# EAGLE design tvikia (EAGLE 5.06)
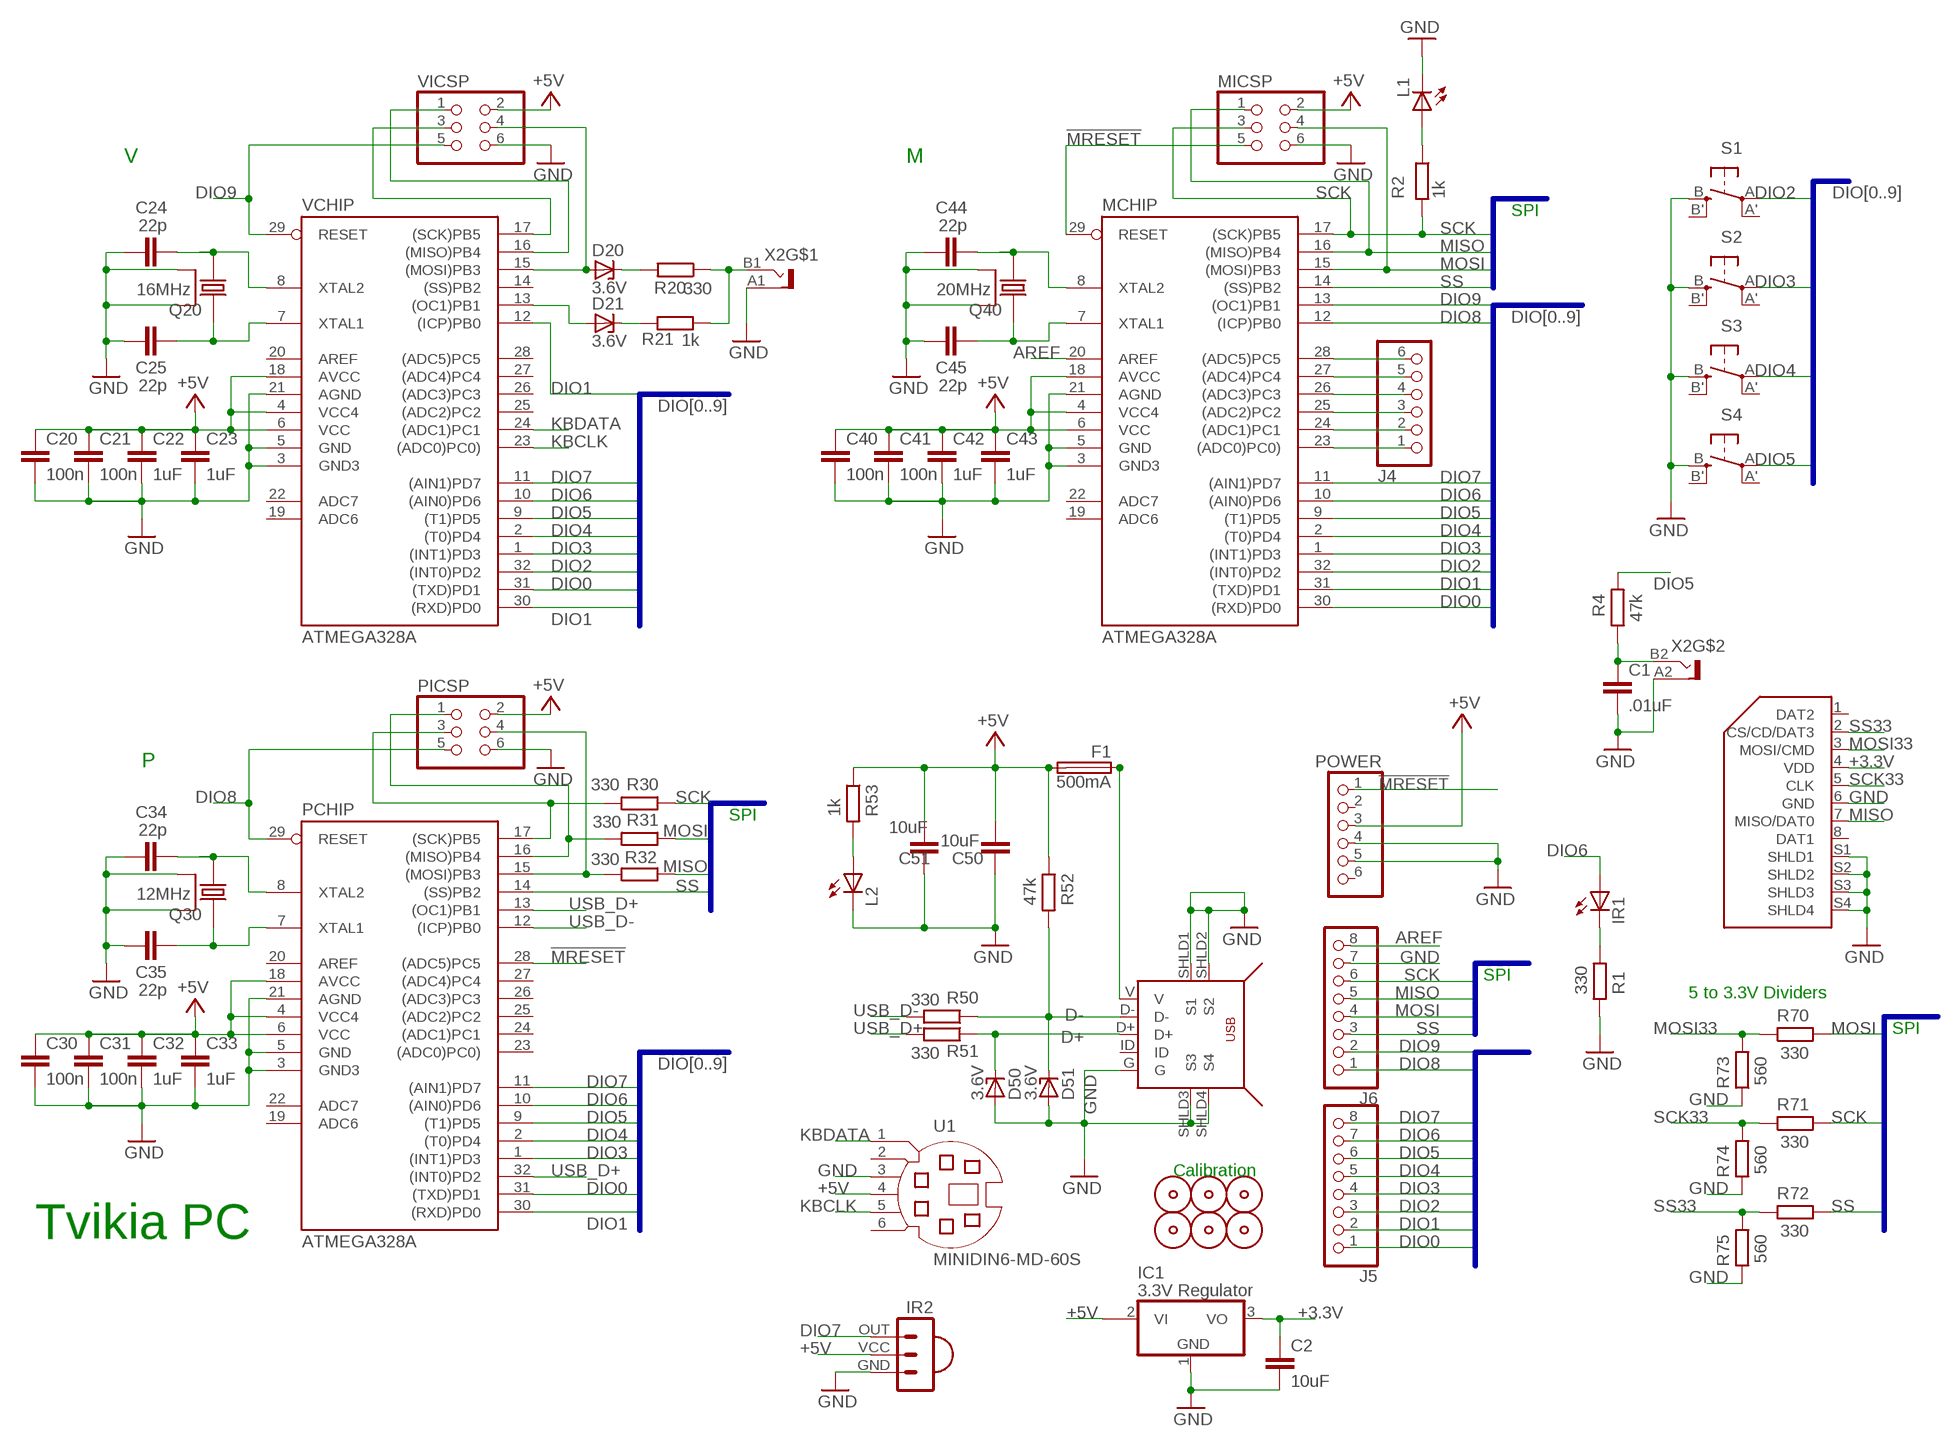
[diagram p0: schematic, sheet 1]

## Parts
C1  .01uF  C-EUC0603  [C0603]
C2  10uF  C-EUC0603  [C0603]
C20  100n  C-EUC0603  [C0603]
C21  100n  C-EUC0603  [C0603]
C22  1uF  C-EUC0603  [C0603]
C23  1uF  C-EUC0603  [C0603]
C24  22p  C-EUC0603  [C0603]
C25  22p  C-EUC0603  [C0603]
C30  100n  C-EUC0603  [C0603]
C31  100n  C-EUC0603  [C0603]
C32  1uF  C-EUC0603  [C0603]
C33  1uF  C-EUC0603  [C0603]
C34  22p  C-EUC0603  [C0603]
C35  22p  C-EUC0603  [C0603]
C40  100n  C-EUC0603  [C0603]
C41  100n  C-EUC0603  [C0603]
C42  1uF  C-EUC0603  [C0603]
C43  1uF  C-EUC0603  [C0603]
C44  22p  C-EUC0603  [C0603]
C45  22p  C-EUC0603  [C0603]
C50  10uF  C-EUC0603  [C0603]
C51  10uF  C-EUC0603  [C0603]
D20  3.6V  ZENER-DIODESOT23  [SOT23]
D21  3.6V  ZENER-DIODESOT23  [SOT23]
D50  3.6V  ZENER-DIODESOT23  [SOT23]
D51  3.6V  ZENER-DIODESOT23  [SOT23]
F1  500mA  FUSE0402  [0402]
IC1  3.3V Regulator  MCP170312MB  [SOT89]
IR1  LED5MM  [LED5MM]
IR2  IR-RECV-TSOP323  [IR-RECV-TSOP323]
J4  PINHD-1X6-CIRC  [1X06]
J5  PINHD-1X8-CIRC  [1X08]
J6  PINHD-1X8-CIRC  [1X08]
L1  LEDCHIP-LED0603  [CHIP-LED0603]
L2  LEDCHIPLED_0603  [CHIPLED_0603]
MCHIP  ATMEGA328A  [TQFP32-08]
MICSP  PINHD-2X3  [2X03]
PCHIP  ATMEGA328A  [TQFP32-08]
PICSP  PINHD-2X3  [2X03]
POWER  PINHD-1X6-CIRC  [1X06]
Q20  16MHz  NX3225SA  [NX3225SA]
Q30  12MHz  NX3225SA  [NX3225SA]
Q40  20MHz  NX3225SA  [NX3225SA]
R1  330  R-EU_R0603  [R0603]
R2  1k  R-EU_R0603  [R0603]
R4  47k  R-EU_R0603  [R0603]
R20  330  R-EU_R0603  [R0603]
R21  1k  R-EU_R0603  [R0603]
R30  330  R-EU_R0603  [R0603]
R31  330  R-EU_R0603  [R0603]
R32  330  R-EU_R0603  [R0603]
R50  330  R-EU_R0603  [R0603]
R51  330  R-EU_R0603  [R0603]
R52  47k  R-EU_R0603  [R0603]
R53  1k  R-EU_R0603  [R0603]
R70  330  R-EU_R0603  [R0603]
R71  330  R-EU_R0603  [R0603]
R72  330  R-EU_R0603  [R0603]
R73  560  R-EU_R0603  [R0603]
R74  560  R-EU_R0603  [R0603]
R75  560  R-EU_R0603  [R0603]
S1  EVQ-Q2P02W  [EVQ-Q2P02W]
S2  EVQ-Q2P02W  [EVQ-Q2P02W]
S3  EVQ-Q2P02W  [EVQ-Q2P02W]
S4  EVQ-Q2P02W  [EVQ-Q2P02W]
U1  MINIDIN6-MD-60S  [MINIDIN6-MD-60S]
U$1  CALIBRATION-MARK  [CALIBRATION-MARK]
U$4  CALIBRATION-MARK  [CALIBRATION-MARK]
U$5  CALIBRATION-MARK  [CALIBRATION-MARK]
U$6  CALIBRATION-MARK  [CALIBRATION-MARK]
U$8  MICROUSB-ZX62-B-5PA  [MICROUSB-ZX62-B-5PA]
U$9  MICROSD_3M_2900  [MICROSD_3M_2900]
U$10  CALIBRATION-MARK  [CALIBRATION-MARK]
U$12  CALIBRATION-MARK  [CALIBRATION-MARK]
VCHIP  ATMEGA328A  [TQFP32-08]
VICSP  PINHD-2X3  [2X03]
X2  DUAL-PHONO-161-4218-E  [DUAL-PHONO-161-4218-E]

## Nets
!MRESET: MCHIP.29(RESET) MICSP.5 PCHIP.28((ADC5)PC5) POWER.1
+3.3V: C2.1 IC1.3(VO) U$9.4(VDD)
+5V: C20.1 C21.1 C22.1 C23.1 C30.1 C31.1 C32.1 C33.1 C40.1 C41.1 C42.1 C43.1 C50.1 C51.1 F1.2 IC1.2@1(VI1) IR2.VCC MCHIP.4(VCC4) MCHIP.6(VCC) MCHIP.18(AVCC) MICSP.2 PCHIP.4(VCC4) PCHIP.6(VCC) PCHIP.18(AVCC) PICSP.2 POWER.3 R52.1 R53.1 U1.4 VCHIP.4(VCC4) VCHIP.6(VCC) VCHIP.18(AVCC) VICSP.2
AREF: J6.8 MCHIP.20(AREF)
D+: D50.3(C) R51.1 U$8.D+
D-: D51.3(C) R50.1 R52.2 U$8.D-
DIO0: J5.1 MCHIP.30((RXD)PD0) PCHIP.31((TXD)PD1) VCHIP.31((TXD)PD1)
DIO1: J5.2 MCHIP.31((TXD)PD1) PCHIP.30((RXD)PD0) VCHIP.12((ICP)PB0) VCHIP.30((RXD)PD0)
DIO2: J5.3 MCHIP.32((INT0)PD2) S1.A(P) VCHIP.32((INT0)PD2)
DIO3: J5.4 MCHIP.1((INT1)PD3) PCHIP.1((INT1)PD3) S2.A(P) VCHIP.1((INT1)PD3)
DIO4: J5.5 MCHIP.2((T0)PD4) PCHIP.2((T0)PD4) S3.A(P) VCHIP.2((T0)PD4)
DIO5: J5.6 MCHIP.9((T1)PD5) PCHIP.9((T1)PD5) R4.2 S4.A(P) VCHIP.9((T1)PD5)
DIO6: IR1.A J5.7 MCHIP.10((AIN0)PD6) PCHIP.10((AIN0)PD6) VCHIP.10((AIN0)PD6)
DIO7: IR2.OUT J5.8 MCHIP.11((AIN1)PD7) PCHIP.11((AIN1)PD7) VCHIP.11((AIN1)PD7)
DIO8: J6.1 MCHIP.12((ICP)PB0) PCHIP.29(RESET) PICSP.5
DIO9: J6.2 MCHIP.13((OC1)PB1) VCHIP.29(RESET) VICSP.5
GND [power]: C1.2 C2.2 C20.2 C21.2 C22.2 C23.2 C24.1 C25.1 C30.2 C31.2 C32.2 C33.2 C34.1 C35.1 C40.2 C41.2 C42.2 C43.2 C44.1 C45.1 C50.2 C51.2 D50.1(A) D51.1(A) IC1.1(GND) IR2.GND J6.7 L1.C L2.C MCHIP.3(GND3) MCHIP.5(GND) MCHIP.21(AGND) MICSP.6 PCHIP.3(GND3) PCHIP.5(GND) PCHIP.21(AGND) PICSP.6 POWER.4 POWER.5 Q20.2(GND2) Q20.4(GND) Q30.2(GND2) Q30.4(GND) Q40.2(GND2) Q40.4(GND) R1.2 R73.1 R74.1 R75.1 S1.B(S) S2.B(S) S3.B(S) S4.B(S) U1.3 U$8.G U$8.SHLD1(S1) U$8.SHLD2(S2) U$8.SHLD3(S3) U$8.SHLD4(S4) U$9.6(GND) U$9.S1(SHLD1) U$9.S2(SHLD2) U$9.S3(SHLD3) U$9.S4(SHLD4) VCHIP.3(GND3) VCHIP.5(GND) VCHIP.21(AGND) VICSP.6 X2.A1 X2.A2
KBCLK: U1.5 VCHIP.23((ADC0)PC0))
KBDATA: U1.1 VCHIP.24((ADC1)PC1)
MISO: J6.5 MCHIP.16((MISO)PB4) MICSP.1 R32.1 U$9.7(MISO/DAT0)
MOSI: J6.4 MCHIP.15((MOSI)PB3) MICSP.4 R31.1 R70.2
MOSI33: R70.1 R73.2 U$9.3(MOSI/CMD)
N$2: IR1.K(C) R1.1
N$3: L2.A R53.2
N$4: C34.2 PCHIP.8(XTAL2) Q30.1
N$5: C1.1 R4.1 X2.B2
N$8: F1.1 U$8.V
N$9: VCHIP.16((MISO)PB4) VICSP.1
N$10: C24.2 Q20.1 VCHIP.8(XTAL2)
N$11: C25.2 Q20.3 VCHIP.7(XTAL1)
N$12: D20.3(C) R20.2
N$13: D21.1(A) VCHIP.13((OC1)PB1)
N$14: D21.3(C) R21.1
N$15: R20.1 R21.2 X2.B1
N$23: C35.2 PCHIP.7(XTAL1) Q30.3
N$24: VCHIP.17((SCK)PB5) VICSP.3
N$28: C44.2 MCHIP.8(XTAL2) Q40.1
N$29: C45.2 MCHIP.7(XTAL1) Q40.3
N$30: J4.1 MCHIP.23((ADC0)PC0))
N$31: J4.2 MCHIP.24((ADC1)PC1)
N$32: J4.3 MCHIP.25((ADC2)PC2)
N$33: J4.4 MCHIP.26((ADC3)PC3)
N$34: J4.5 MCHIP.27((ADC4)PC4)
N$35: J4.6 MCHIP.28((ADC5)PC5)
N$37: L1.A R2.1
PIXEL1: D20.1(A) VCHIP.15((MOSI)PB3) VICSP.4
PMISO: PCHIP.15((MOSI)PB3) PICSP.4 R32.2
PMOSI: PCHIP.16((MISO)PB4) PICSP.1 R31.2
PSCK: PCHIP.17((SCK)PB5) PICSP.3 R30.2
SCK: J6.6 MCHIP.17((SCK)PB5) MICSP.3 R2.2 R30.1 R71.2
SCK33: R71.1 R74.2 U$9.5(CLK)
SS: J6.3 MCHIP.14((SS)PB2) PCHIP.14((SS)PB2) R72.2
SS33: R72.1 R75.2 U$9.2(CS/CD/DAT3)
USB_D+: PCHIP.13((OC1)PB1) PCHIP.32((INT0)PD2) R51.2
USB_D-: PCHIP.12((ICP)PB0) R50.2
Unconnected: IC1.2(VI) MCHIP.19(ADC6) MCHIP.22(ADC7) PCHIP.19(ADC6) PCHIP.20(AREF) PCHIP.22(ADC7) PCHIP.23((ADC0)PC0)) PCHIP.24((ADC1)PC1) PCHIP.25((ADC2)PC2) PCHIP.26((ADC3)PC3) PCHIP.27((ADC4)PC4) POWER.2 POWER.6 S1.A'(P1) S1.B'(S1) S2.A'(P1) S2.B'(S1) S3.A'(P1) S3.B'(S1) S4.A'(P1) S4.B'(S1) U1.2 U1.6 U$8.ID U$9.1(DAT2) U$9.8(DAT1) VCHIP.14((SS)PB2) VCHIP.19(ADC6) VCHIP.20(AREF) VCHIP.22(ADC7) VCHIP.25((ADC2)PC2) VCHIP.26((ADC3)PC3) VCHIP.27((ADC4)PC4) VCHIP.28((ADC5)PC5)

## Buses
DIO[0..9]
SPI:SCK,MOSI,MISO,SS

## Notes on the sheet
- V | M
- SPI
- P
- SPI
- SPI
- 5 to 3.3V Dividers
- SPI
- Calibration
- Tvikia PC

## Library data of the parts
C1 C2 C20-C25 C30-C35 C40-C45 C50 C51 = rcl:C-EU: CAPACITOR, European symbol
D20 D21 D50 D51 = diode:ZENER-DIODE: Z-Diode
F1 = tvikia:FUSE0402
IC1 = linear:MCP1703*: 250 mA, 16V, Low Quiescent Current LDO Regulator Source: http://ww1.microchip.com/downloads/en/DeviceDoc/22049b.pdf
IR1 L1 L2 = led:LED: LED OSRAM: - CHIPLED LG R971, LG N971, LY N971, LG Q971, LY Q971, LO R971, LY R971 LH N974, LH R974 LS Q976, LO Q976, LY Q976 LO Q996 - Hyper CHIPLED LW Q18S LB Q993, LB Q99A, LB R99A - SideLED LS A670, LO A670, LY A670, LG A670, LP A670 LB A673, LV A673, LT A673, LW A673 LH A674 LY A675 LS A676, LA A676, LO A676, LY A676, LW A676 LS A679, LY A679, LG A679 - Hyper Micro SIDELED® LS Y876, LA Y876, LO Y876, LY Y876 LT Y87S - SmartLED LW L88C, LW L88S LB L89C, LB L89S, LG L890 LS L89K, LO L89K, LY L89K LS L896, LA L896, LO L896, LY L896 - TOPLED LS T670, LO T670, LY T670, LG T670, LP T670 LSG T670, LSP T670, LSY T670, LOP T670, LYG T670 LG T671, LOG T671, LSG T671 LB T673, LV T673, LT T673, LW T673 LH T674 LS T676, LA T676, LO T676, LY T676, LB T676, LH T676, LSB T676, LW T676 LB T67C, LV T67C, LT T67C, LS T67K, LO T67K, LY T67K, LW E67C LS E67B, LA E67B, LO E67B, LY E67B, LB E67C, LV E67C, LT E67C LW T67C LS T679, LY T679, LG T679 LS T770, LO T770, LY T770, LG T770, LP T770 LB T773, LV T773, LT T773, LW T773 LH T774 LS E675, LA E675, LY E675, LS T675 LS T776, LA T776, LO T776, LY T776, LB T776 LHGB T686 LT T68C, LB T68C - Hyper Mini TOPLED® LB M676 - Mini TOPLED Santana® LG M470 LS M47K, LO M47K, LY M47K Source: http://www.osram.convergy.de LUXEON: - LUMILED® LXK2-PW12-R00, LXK2-PW12-S00, LXK2-PW14-U00, LXK2-PW14-V00 LXK2-PM12-R00, LXK2-PM12-S00, LXK2-PM14-U00 LXK2-PE12-Q00, LXK2-PE12-R00, LXK2-PE12-S00, LXK2-PE14-T00, LXK2-PE14-U00 LXK2-PB12-K00, LXK2-PB12-L00, LXK2-PB12-M00, LXK2-PB14-N00, LXK2-PB14-P00, LXK2-PB14-Q00 LXK2-PR12-L00, LXK2-PR12-M00, LXK2-PR14-Q00, LXK2-PR14-R00 LXK2-PD12-Q00, LXK2-PD12-R00, LXK2-PD12-S00 LXK2-PH12-R00, LXK2-PH12-S00 LXK2-PL12-P00, LXK2-PL12-Q00, LXK2-PL12-R00 Source: www.luxeon.com KINGBRIGHT: KA-3528ASYC Source: www.kingbright.com
IR2 = tvikia:IR-RECV-TSOP323
J4 POWER = tvikia:PINHD-1X6-CIRC: PIN HEADER
J5 J6 = tvikia:PINHD-1X8-CIRC: PIN HEADER
MCHIP PCHIP VCHIP = tvikia:ATMEGA328: MICROCONTROLLER 4 Kbytes FLASH 128 bytes SRAM 256 bytes EEPROM UART 6-channel 10 bit ADC
MICSP PICSP VICSP = pinhead:PINHD-2X3: PIN HEADER
Q20 Q30 Q40 = tvikia:NX3225SA
R1 R2 R4 R20 R21 R30-R32 R50-R53 R70-R75 = rcl:R-EU_: RESISTOR, European symbol
S1-S4 = tvikia:EVQ-Q2P02W
U1 = tvikia:MINIDIN6-MD-60S
U$1 U$4-U$6 U$10 U$12 = tvikia:CALIBRATION-MARK: Calibration mark for board pick-n-place.
U$8 = tvikia:MICROUSB-ZX62-B-5PA
U$9 = tvikia:MICROSD_3M_2900
X2 = tvikia:DUAL-PHONO-161-4218-E

## Net classes
0 default: width 0.203 mm, drill 0.305 mm, clearance 0.203 mm
1 power: width 0.356 mm, drill 0.305 mm, clearance 0.203 mm
2 gnd: width 0.356 mm, drill 0.305 mm, clearance 0.203 mm

## Board
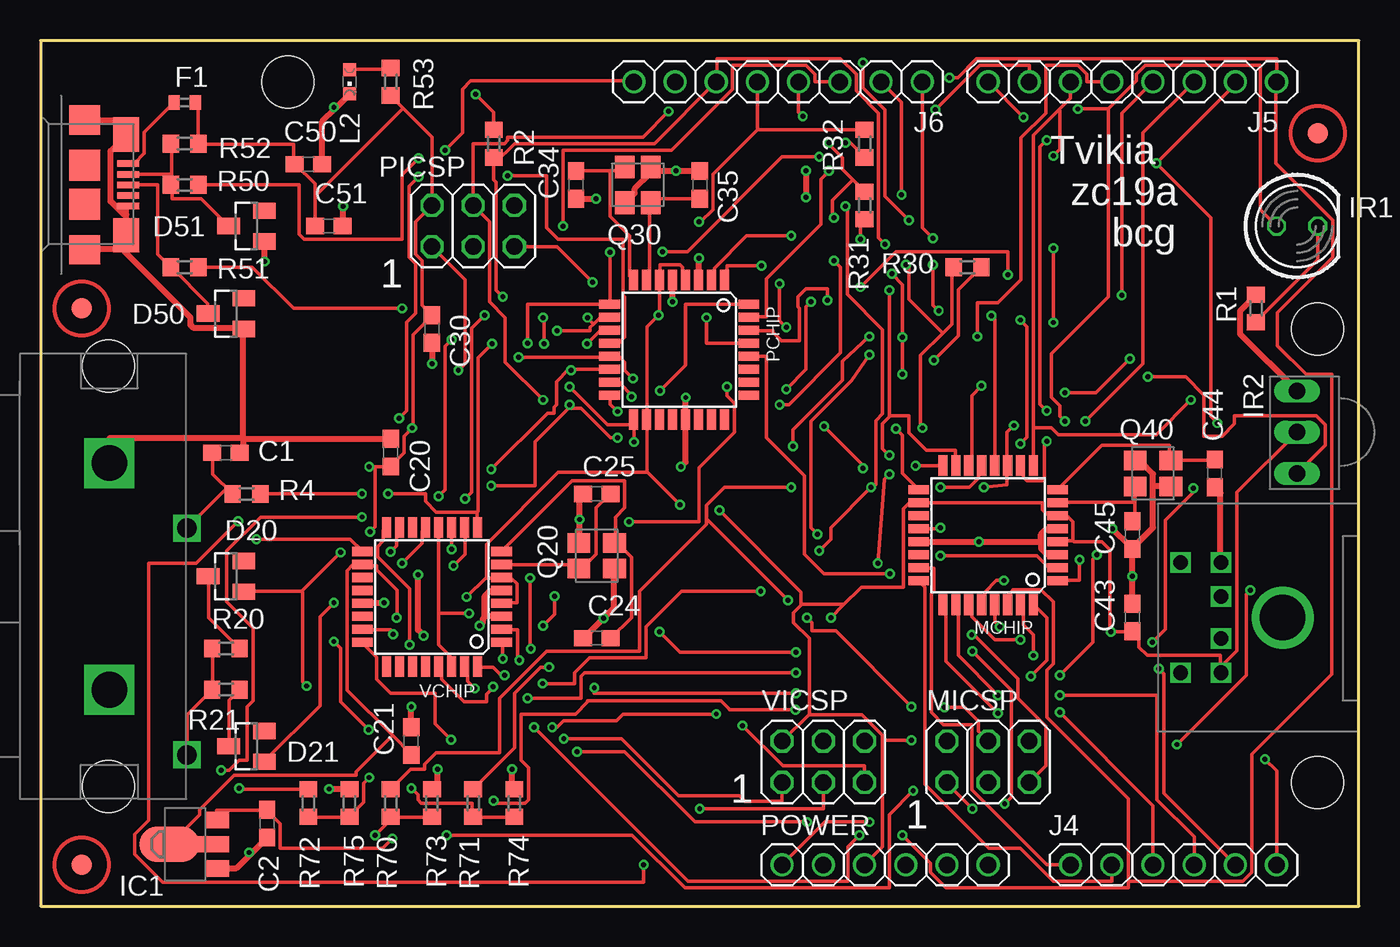
[diagram p1: board, top side]
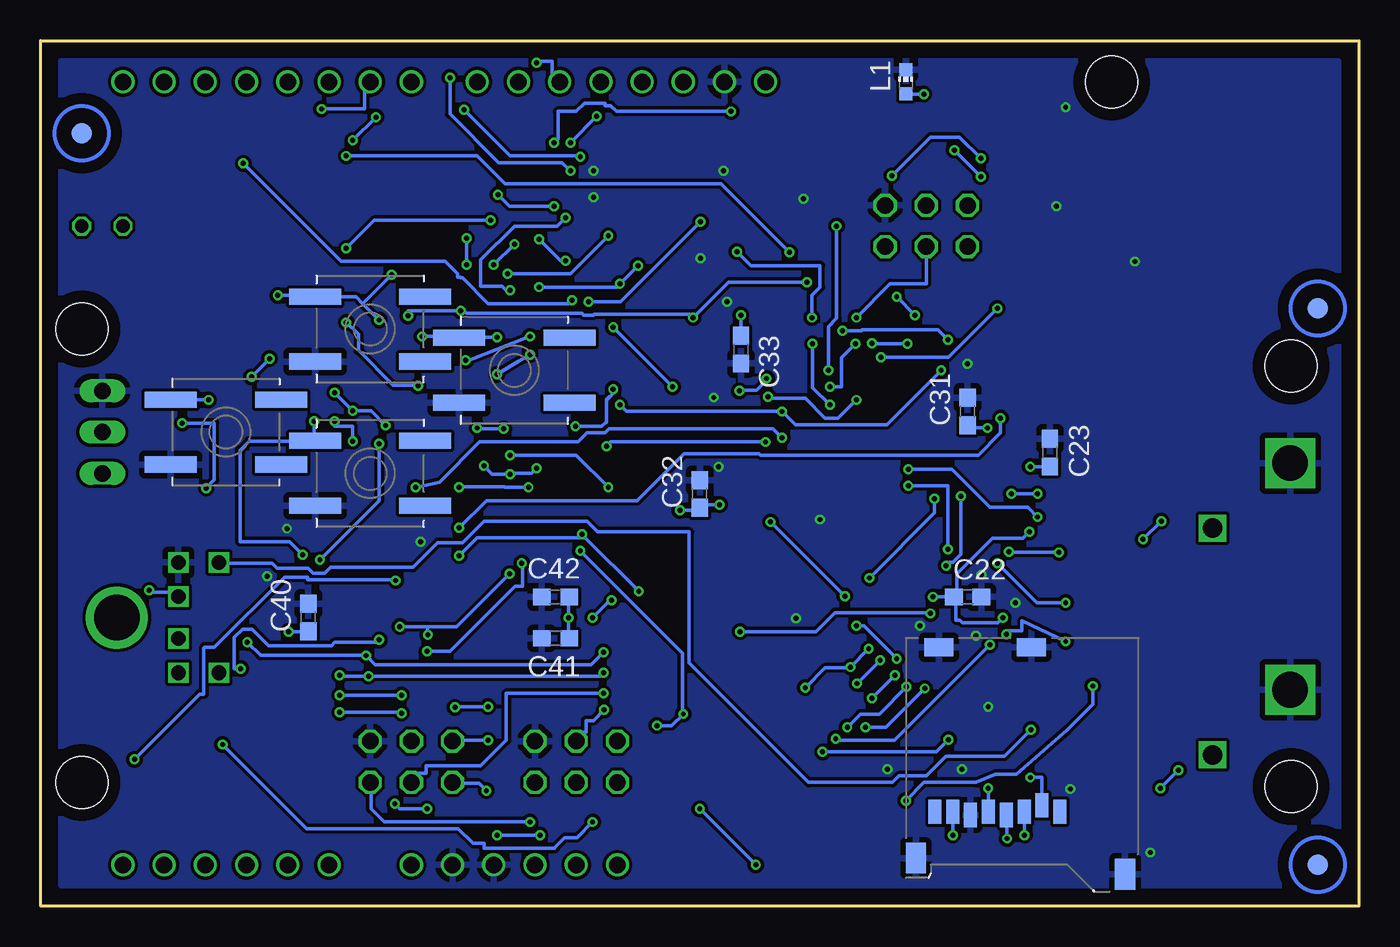
[diagram p2: board, bottom side, seen from below]

Size 81.28 x 53.34 mm. Coordinates in mm from the lower left corner, seen from the top.
Outline: 0,0 81.28,0 81.28,53.34 0,53.34 0,0
Copper layers (1*16): Top 0.035mm / dielectric 1.5mm / Bottom 0.035mm
Design rules "chung_nam_design_rules *": minimum track width 8mil, minimum drill 12mil, track to track 8mil, track to pad 8mil, pad to pad 5mil, via to via 15mil, smd to smd 5mil, copper to edge 30mil, drill to drill 30mil, minimum pad ring 7mil, minimum via ring 6mil, stop-mask expansion 3mil, vias tented up to drill 0mil, thermal gap 14mil
Holes 3.2 mm at 15.24,50.8 78.74,35.56 78.74,7.62

### Footprints (pad centres in the part's own frame; a part is rotated, then mirrored left to right if it is on the bottom)
C0603 = smd 1.1 x 1: 1 -0.85,0; 2 0.85,0
SOT23 = smd 1 x 1.4: 1 -0.95,-1.1; 2 0.95,-1.1; 3 0,1.1
0402 = smd 0.7 x 0.9: 1 -0.65,0; 2 0.65,0
SOT89 = smd 1 x 1.5: 1 -1.499,-1.981; 3 1.499,-1.981 | smd 1 x 2: 2 0,-1.727 | smd 2.2 x 3.7: 2@1 0,0.94
LED5MM = drill 0.813 octagon: A -1.27,0; K 1.27,0
IR-RECV-TSOP323 = drill 1.016 long: GND -2.54,0; OUT 2.54,0; VCC 0,0
1X06 = drill 1.016 round: 1 -6.35,0; 2 -3.81,0; 3 -1.27,0; 4 1.27,0; 5 3.81,0; 6 6.35,0
1X08 = drill 1.016 round: 1 -8.89,0; 2 -6.35,0; 3 -3.81,0; 4 -1.27,0; 5 1.27,0; 6 3.81,0; 7 6.35,0; 8 8.89,0
CHIP-LED0603 = smd 0.8 x 0.8: A 0,-0.75; C 0,0.75
CHIPLED_0603 = smd 0.8 x 0.8: A 0,-0.75; C 0,0.75
TQFP32-08 = smd 1.27 x 0.559: 1 -4.293,2.8; 2 -4.293,2; 3 -4.293,1.2; 4 -4.293,0.4; 5 -4.293,-0.4; 6 -4.293,-1.2; 7 -4.293,-2; 8 -4.293,-2.8; 17 4.293,-2.8; 18 4.293,-2; 19 4.293,-1.2; 20 4.293,-0.4; 21 4.293,0.4; 22 4.293,1.2; 23 4.293,2; 24 4.293,2.8 | smd 0.559 x 1.27: 9 -2.8,-4.293; 10 -2,-4.293; 11 -1.2,-4.293; 12 -0.4,-4.293; 13 0.4,-4.293; 14 1.2,-4.293; 15 2,-4.293; 16 2.8,-4.293; 25 2.8,4.293; 26 2,4.293; 27 1.2,4.293; 28 0.4,4.293; 29 -0.4,4.293; 30 -1.2,4.293; 31 -2,4.293; 32 -2.8,4.293
2X03 = drill 1.016 octagon: 1 -2.54,-1.27; 2 -2.54,1.27; 3 0,-1.27; 4 0,1.27; 5 2.54,-1.27; 6 2.54,1.27
NX3225SA = smd 1.4 x 1.2: 1 -1.1,-0.8; 2 1.1,-0.8; 3 1.1,0.8; 4 -1.1,0.8
R0603 = smd 1 x 1.1: 1 -0.85,0; 2 0.85,0
EVQ-Q2P02W = smd 3.2 x 1: A -3.4,2; A' 3.4,2; B -3.4,-2; B' 3.4,-2
MINIDIN6-MD-60S = drill 0.9 square: 1 -1.3,-8.5; 2 1.3,-8.5; 3 -3.4,-8.5; 4 3.4,-8.5; 5 -3.4,-11; 6 3.4,-11 | drill 2.8 round: P$7 0,-4.7
CALIBRATION-MARK = smd 1.27 x 1.27: P$1 0,0
MICROUSB-ZX62-B-5PA = smd 0.4 x 1.35: D+ 0,4.13; D- -0.65,4.13; G 1.3,4.13; ID 0.65,4.13; V -1.3,4.13 | smd 1.9 x 1.9: P$8 1.2,1.45; P$9 -1.2,1.45 | smd 2.1 x 1.6: SHLD1 -3.1,4; SHLD2 3.1,4 | smd 1.8 x 1.9: SHLD3 -4,1.45; SHLD4 4,1.45
MICROSD_3M_2900 = smd 0.8 x 1.5: 1 -9.5,10.7; 2 -8.4,10.3; 3 -7.3,10.7; 4 -6.2,10.9; 5 -5.1,10.7; 6 -4,10.9; 7 -2.9,10.7; 8 -1.8,10.7 | smd 1.24 x 1.9: S1 -13.52,14.55; S2 -0.62,13.55 | smd 1.8 x 1.1: S3 -7.75,0.55; S4 -2.05,0.55
DUAL-PHONO-161-4218-E = drill 2.2 square: A1 -6.985,-5.512; A2 6.985,-5.512 | drill 1.2 square: B1 -10.998,-10.287; B2 2.972,-10.287 | hole 3.2: -12.954,-5.461; 12.954,-5.461

### Placement (x,y rotation side)
C1  11.43,27.94 0 top
C2  13.97,5.08 270 top
C20  21.59,27.94 90 top
C21  22.86,10.16 90 top
C22  24.13,19.05 0 bottom
C23  19.05,27.94 90 bottom
C24  34.29,16.51 0 top
C25  34.29,25.4 0 top
C30  24.13,35.56 270 top
C31  24.13,30.48 90 bottom
C32  40.64,25.4 90 bottom
C33  38.1,34.29 270 bottom
C34  33.02,44.45 90 top
C35  40.64,44.45 270 top
C40  64.77,17.78 90 bottom
C41  49.53,16.51 180 bottom
C42  49.53,19.05 180 bottom
C43  67.31,17.78 90 top
C44  72.39,26.67 90 top
C45  67.31,22.86 90 top
C50  16.51,45.72 0 top
C51  17.78,41.91 0 top
D20  11.43,20.32 90 top
D21  12.7,9.84 90 top
D50  11.43,36.51 90 top
D51  12.7,41.91 90 top
F1  8.89,49.53 0 top
IC1  8.89,3.81 90 top
IR1  77.47,41.91 0 top
IR2  77.47,29.21 270 top
J4  69.85,2.54 0 top
J5  67.31,50.8 180 top
J6  45.47,50.8 180 top
L1  27.94,50.8 0 bottom
L2  19.05,50.8 180 top
MCHIP  58.42,22.86 180 top
MICSP  58.42,8.89 0 top
PCHIP  39.37,34.29 270 top
PICSP  26.67,41.91 0 top
POWER  52.07,2.54 0 top
Q20  34.29,21.59 180 top
Q30  36.83,44.45 270 top
Q40  68.58,26.67 180 top
R1  74.93,36.83 90 top
R2  27.94,46.99 270 top
R4  12.7,25.4 0 top
R20  11.43,15.88 0 top
R21  11.43,13.34 180 top
R30  57.15,39.37 0 top
R31  50.8,43.18 270 top
R32  50.8,46.99 270 top
R50  8.89,44.45 0 top
R51  8.89,39.37 0 top
R52  8.89,46.99 180 top
R53  21.59,50.8 90 top
R70  21.59,6.35 90 top
R71  26.67,6.35 90 top
R72  16.51,6.35 90 top
R73  24.13,6.35 270 top
R74  29.21,6.35 270 top
R75  19.05,6.35 270 top
S1  60.96,26.67 0 bottom
S2  60.96,35.56 0 bottom
S3  52.07,33.02 0 bottom
S4  69.85,29.21 0 bottom
U1  81.28,17.78 270 top
U$1  78.74,47.62 0 bottom
U$4  2.54,2.54 0 top
U$5  78.74,47.62 0 top
U$6  2.54,36.83 0 top
U$8  1.27,44.45 270 top
U$9  27.94,16.51 180 bottom
U$10  2.54,2.54 0 bottom
U$12  2.54,36.83 0 bottom
VCHIP  24.13,19.05 180 top
VICSP  48.26,8.89 0 top
X2  -1.27,20.32 90 top

### Tracks (layer width: path | path; a pad name or v marks a point on that pad's centre or on a via)
!MRESET  (via drill 0.3)
  Top 0.203: POWER.1 48.36,5.18 v51.1,5.18 | v52.38,20.47 48.31,20.47 47.09,21.69 47.09,26.52 44.76,28.85 44.76,33.88 43.69,33.88 PCHIP.28 | v59.13,17.22 58.83,17.53 58.83,18.54 MCHIP.29 | MICSP.5 61.98,8.64 61.98,11.07 60.25,12.8 60.25,14.02 57.56,16.71 v57.4,16.71
  Bottom 0.203: v51.1,5.18 60.1,5.18 60.91,5.99 60.91,7.62 MICSP.5 | v52.38,20.47 55.63,17.22 57.4,17.22 | 57.4,17.22 v59.13,17.22 | v57.4,16.71 57.4,17.22
+3.3V  (via drill 0.3)
  Top 0.203: IC1.3 10.87,5.33 10.87,5.89 13.97,5.89 C2.1 14.02,5.84 14.78,5.08 14.78,3.56 21.08,3.56 v21.69,4.17
  Bottom 0.203: v21.69,4.17 21.69,5.59 U$9.4
+5V  (via drill 0.3)
  Top 0.203: 20.62,27.08 21.59,27.08 C20.1 21.64,27.18 22.4,27.94 22.4,28.96 v22.91,29.46 22.96,29.52 22.96,35.2 24.13,36.37 C30.1 24.08,36.47 23.52,37.03 23.52,39.78 23.11,40.18 23.11,42.16 PICSP.2 24.13,47.4 22.35,49.17 | 20.62,27.08 v20.27,27.08 | 22.35,49.17 21.59,49.94 R53.1 | F1.2 9.7,49.38 9.7,46.99 R52.1 9.8,46.94 15.6,46.94 15.6,45.77 C50.1 15.7,45.72 16.92,44.5 16.92,43.79 | 16.92,43.79 16.92,41.91 C51.1 | 22.35,49.17 16.97,43.79 16.92,43.79 | 21.69,10.52 18.9,13.31 18.9,20.68 19.25,21.03 19.81,21.03 VCHIP.18 19.91,20.98 20.73,20.98 20.73,20.73 22,19.46 22,17.83 v21.95,17.78 | 21.69,10.52 22.86,9.35 C21.1 | IC1.2@1 7.98,3.81 9.8,5.64 9.8,5.94 11.94,8.08 19.46,8.08 19.46,8.28 21.69,10.52 | PCHIP.4 39.73,38.61 39.57,38.76 39.57,39.37 39.42,39.52 38.2,39.52 38.2,38.66 PCHIP.6 38.15,38.56 38.15,36.47 v38.1,36.42 37.39,35.71 37.39,30.07 PCHIP.18 37.39,29.97 37.39,26.77 | v26.26,19.05 27.43,20.22 | 27.43,20.22 28.4,20.22 VCHIP.6 28.5,20.22 29.01,20.22 29.36,19.86 29.36,18.69 28.45,18.69 VCHIP.4 | 37.39,26.77 v39.42,24.74 | 27.43,20.22 27.48,20.27 27.48,22.3 31.9,26.72 37.34,26.72 37.39,26.77 | IR2.VCC 73.76,25.5 73.76,15.75 72.8,14.78 U1.4 72.75,14.43 72.75,15.44 68.22,15.44 67.72,15.95 67.72,16.51 67.36,16.87 C43.1 67.31,16.92 v65.99,16.92 65.94,16.97 65.94,21.95 65.43,22.45 63.7,22.45 63.65,22.5 | 63.65,22.5 62.74,22.5 MCHIP.4 | 63.65,22.5 63.65,23.67 63.3,24.03 62.74,24.03 MCHIP.6 62.64,24.08 62.13,24.08 61.77,24.43 61.77,24.84 54.15,24.84 MCHIP.18 54.05,24.79 53.49,24.79 53.19,24.49 53.19,19.66 50.6,19.66 49.48,18.54 | 49.48,18.54 v48.72,17.78
  Top 0.203: 47.4,11.84 VICSP.2 | 47.4,11.84 47.4,16.51 46.43,17.48 46.43,18.09 46.94,18.59 | 46.94,18.59 49.43,18.59 49.48,18.54 | POWER.3 51.92,3.66 51.92,10.21 | 51.92,10.21 51.92,10.52 50.65,11.79 47.45,11.79 47.4,11.84 | 51.92,10.21 v53.7,10.21 | v41.86,24.38 46.89,19.36 46.89,18.64 46.94,18.59 | v20.32,23.06 20.62,23.37 20.62,27.08
  Bottom 0.203: v20.27,27.08 19.05,27.08 C23.1 | v22.91,29.46 23.98,29.46 24.13,29.62 C31.1 | v38.1,36.42 C33.1 | C22.1 v26.26,19.05 | v39.42,24.74 40.49,24.74 40.64,24.59 C32.1 40.69,24.49 40.79,24.38 v41.86,24.38 | v65.99,16.92 64.77,16.92 C40.1 | C41.1 48.72,16.51 v48.72,17.78 48.72,19.05 C42.1 | MICSP.2 55.83,10.21 v53.7,10.21 | v21.95,17.78 22.25,17.48 24.43,17.48 24.59,17.63 24.84,17.63 24.84,19 24.89,19 C22.1 | v20.32,23.06 20.73,22.66 22.61,22.66 24.79,20.47 24.79,19.05 C22.1
AREF  (via drill 0.3)
  Top 0.203: v55.47,23.32 55.47,23.27 54.15,23.27 MCHIP.20 | v22.1,30.07 22.55,30.53 22.55,35.97 23.11,36.52 23.11,39.57 22.71,39.98 22.71,44.35 v23.32,44.96 | v24.94,46.58 26.01,47.65 26.01,50.34 26.52,50.85 36.58,50.85 J6.8
  Bottom 0.203: v55.47,23.32 53.8,24.99 44.5,24.99 41.6,27.89 36.98,27.89 36.88,27.79 23.47,27.79 22.1,29.16 v22.1,30.07 | v23.32,44.96 v24.94,46.58
D+
  Top 0.203: D50.3 10.31,36.52 10.31,37.13 8.08,39.37 R51.1 7.98,39.42 7.21,40.18 7.21,44.45 U$8.D+
D-
  Top 0.203: 8.08,45.11 8.08,46.99 R52.2 | 8.08,45.11 8.08,44.45 R50.1 8.13,44.4 8.13,43.59 9.91,43.59 11.58,41.91 D51.3 | U$8.D- 5.44,45.11 8.08,45.11
DIO0  (via drill 0.3)
  Top 0.203: v48.62,45.31 48.11,44.81 48.11,42.01 44.76,38.66 44.76,36.32 43.69,36.32 PCHIP.31 | v56.03,51.05 56.54,51.05 57.71,52.22 76.2,52.22 J5.1 76.15,50.75 76.15,45.77 79.65,42.27 79.65,39.98 76.25,36.58 76.25,34.54 78.03,32.77 79.6,32.77 79.6,14.28 74.68,9.35 74.68,2.08 74.12,1.52 67.06,1.52 | v26.77,13.41 26.31,13.87 26.31,14.58 26.16,14.73 VCHIP.31 | v30.43,11.02 39.93,1.52 49.78,1.52 49.78,3.66 v50.49,4.37 | v53.14,4.37 54.86,2.64 54.86,2.08 55.83,1.12 67.06,1.12 67.06,1.52 | 67.06,1.52 67.06,6.6 62.03,11.63 62.03,14.53 62.43,14.94 62.43,18.75 61.67,19.51 59.94,19.51 59.94,19.46 59.64,19.15 59.64,18.59 MCHIP.30
  Bottom 0.203: v48.62,45.31 49.12,45.82 53.03,45.82 56.03,48.82 v56.03,51.05 | v26.77,13.41 29.16,11.02 v30.43,11.02 | v50.49,4.37 v53.14,4.37
DIO1  (via drill 0.3)
  Top 0.203: 24.54,18.03 24.54,16.1 25.3,15.34 25.3,14.78 VCHIP.30 | 24.54,18.03 24.54,23.32 VCHIP.12 | v48.51,37.34 48.51,38.05 47.19,38.05 46.69,37.54 46.69,36.93 46.79,36.83 46.79,34.85 45.67,34.85 45.16,35.36 45.16,35.46 43.69,35.46 PCHIP.30 | J5.2 73.66,50.65 v68.78,45.77 72.14,42.42 72.14,30.18 v72.54,29.77 | v61.21,15.44 61.21,16.71 60.6,17.32 60.6,18.39 60.45,18.54 MCHIP.31 | v68.53,16.26 69.34,17.07 69.34,23.77 71.07,25.5 v71.07,25.76 | v38.15,16.92 39.42,15.65 v46.58,15.65 | 24.54,18.03 v26.42,18.03
  Bottom 0.203: v48.51,37.34 48.72,37.13 53.7,37.13 55.27,38.71 55.37,38.71 55.37,38.76 55.58,38.76 55.58,38.96 56.34,39.73 62.74,39.73 v68.78,45.77 | v68.53,16.26 67.72,15.44 v61.21,15.44 60.66,14.88 47.35,14.88 v46.58,15.65 | v71.07,25.76 70.56,26.26 70.56,29.77 v72.54,29.77 | v26.42,18.03 26.47,18.09 32.31,18.09 33.48,16.92 v38.15,16.92
DIO2  (via drill 0.3)
  Top 0.203: J5.3 67.97,47.65 67.97,33.43 v64.41,29.87 | v28.6,14.22 28.4,14.22 27.89,14.73 26.98,14.73 VCHIP.32 | v30.02,12.8 33.33,12.8 33.33,14.17 33.53,14.38 v46.58,14.38 | v61.06,14.17 62.03,15.14 62.03,17.78 61.27,18.54 MCHIP.32 | v65.13,21.64 64.87,21.39 64.87,16.26 v62.84,14.22
  Bottom 0.203: v64.41,29.87 64.41,28.7 64.36,28.7 S1.A 64.47,28.65 68.43,28.65 68.99,28.09 68.99,22.45 65.94,22.45 v65.13,21.64 | v28.6,14.22 v30.02,12.8 | v46.58,14.38 46.79,14.17 v61.06,14.17 62.79,14.17 v62.84,14.22
DIO3  (via drill 0.3)
  Top 0.203: v28.5,15.24 28.5,16.15 28.45,16.2 VCHIP.1 | v30.99,17.27 31.7,17.98 v31.7,19.1 | v36.27,23.67 40.59,23.67 40.59,27.03 42.77,29.21 42.77,30.99 42.32,31.45 v42.32,32 | v45.97,35.66 45.57,36.07 v45.57,38.35 | v44.45,39.47 42.32,39.47 42.32,38.71 42.22,38.61 PCHIP.1 | v64.06,21.34 64.06,20.07 62.74,20.07 MCHIP.1 | v60.4,28.5 60.81,28.91 60.81,35.71 v60.4,36.12 | J5.4 66.65,48.87 v66.65,37.64 | v50.55,38.15 52.73,40.34 59.64,40.34 v59.64,38.91
  Bottom 0.203: v28.5,15.24 30.53,17.27 v30.99,17.27 | v31.7,19.1 v36.27,23.67 | v42.32,32 v45.97,35.66 | v44.45,39.47 v45.57,38.35 45.77,38.15 v50.55,38.15 | v64.06,21.34 60.4,24.99 v60.4,28.5 | 61.42,37.13 61.82,37.54 64.31,37.54 S2.A 64.41,37.64 v66.65,37.64 | 61.42,37.13 v60.4,36.12 | v59.64,38.91 61.42,37.13
DIO4  (via drill 0.3)
  Top 0.203: v29.52,15.14 29.41,15.24 29.41,17.02 28.45,17.02 VCHIP.2 | v30.94,13.72 32.92,13.72 32.92,14.38 33.83,15.29 37.34,15.29 37.34,17.22 39.52,19.41 v44.4,19.41 | v55.47,21.59 61.42,21.59 62.13,20.88 62.69,20.88 MCHIP.2 | v46.28,41.3 43.54,41.3 41.55,39.32 41.55,38.76 41.4,38.61 PCHIP.2 | v52.48,38.96 53.14,38.3 v53.14,35.05 v53.14,32.77 | J5.5 64.52,50.8 64.52,51.26 63.96,51.82 61.98,51.82 61.98,48.87 60.45,47.35 60.45,38.61 59.03,37.19 57.76,37.19 v57.76,35.1 | v47.9,22.91 47.5,23.32 47.5,29.87 49.99,32.36 v51.1,33.98
  Bottom 0.203: v29.52,15.14 v30.94,13.72 | v44.4,19.41 47.7,22.71 47.9,22.71 | 47.9,22.71 54.36,22.71 v55.47,21.59 | v46.28,41.3 48.62,38.96 v52.48,38.96 | v53.14,35.05 55.42,35.05 S3.A 55.52,35.1 v57.76,35.1 | v51.1,33.98 51.82,33.58 v53.14,32.77 | 47.9,22.71 v47.9,22.91
DIO5  (via drill 0.3)
  Top 0.203: v21.44,25.4 23.72,25.4 23.72,24.94 24.38,24.28 26.92,24.28 | 26.92,24.28 26.92,23.37 VCHIP.9 | R4.2 v19.81,25.4 | v30.02,34.7 30.02,37.08 35.05,37.08 PCHIP.9 35.1,37.19 v35.1,40.28 | v27.84,34.65 26.98,33.78 26.98,24.33 26.92,24.28 | 61.21,29.46 61.21,47.5 62.79,49.07 | 61.21,29.46 61.21,27.18 MCHIP.9 | 62.79,49.07 63.5,49.78 J5.6 | v70.92,31.19 68.78,29.06 62.74,29.06 62.33,29.46 61.21,29.46 | v62.43,46.23 62.84,46.63 62.84,49.02 62.79,49.07
  Bottom 0.203: v19.81,25.4 v21.44,25.4 | v30.02,34.7 29.97,34.65 v27.84,34.65 | v70.92,31.19 73.2,31.19 S4.A | v35.1,40.28 39.32,44.5 52.63,44.5 54.36,46.23 v62.43,46.23
DIO6  (via drill 0.3)
  Top 0.203: v25.45,20.98 26.16,21.69 26.16,23.32 VCHIP.10 | v24.54,25.25 24.94,25.65 24.94,34.49 v25.35,34.9 | v31.85,35.46 33.88,35.46 33.88,35.66 34.09,35.87 | 34.09,35.87 34.49,36.27 35.05,36.27 PCHIP.10 | v62.03,28.65 61.87,28.5 61.87,26.21 60.81,26.21 60.6,26.42 60.6,26.98 60.45,27.13 MCHIP.10 | v63.14,29.87 62.84,30.18 62.84,30.84 62.33,31.34 62.33,34.04 65.84,37.54 65.84,49.12 | 65.84,49.12 67.56,50.85 67.56,51.26 68.12,51.82 75.18,51.82 75.18,42.93 IR1.A | v63.96,49.12 65.84,49.12 | v33.73,36.27 33.73,36.22 34.09,35.87 | v38.35,40.34 39.88,40.34 45.72,46.18 v48.01,46.18 | v55.17,49.07 57.91,51.82 60.96,51.82 J5.7
  Bottom 0.203: v25.45,20.98 25.25,21.18 25.04,21.18 24.54,21.69 v24.54,25.25 | v25.35,34.9 25.96,35.51 30.63,35.51 30.68,35.46 v31.85,35.46 | v62.03,28.65 62.03,29.57 63.14,29.57 v63.14,29.87 | J5.7 60.96,50.19 61.32,50.19 61.32,49.12 v63.96,49.12 | v33.73,36.27 33.73,37.64 33.22,38.15 33.22,39.47 37.49,39.47 v38.35,40.34 | v48.01,46.18 48.06,46.23 52.32,46.23 v55.17,49.07
DIO7  (via drill 0.3)
  Top 0.203: v25.35,22 25.35,23.32 VCHIP.11 | v27.79,25.91 30.48,25.91 30.48,28.6 32.61,30.73 v32.61,30.89 32.66,30.68 33.33,30.68 35.15,28.85 v35.56,28.85 | v33.68,34.65 34.49,35.46 35.05,35.46 PCHIP.11 | v59.99,29.62 59.59,29.21 59.59,27.18 MCHIP.11 59.59,27.08 59.59,25.96 v58.17,25.81 | v62.03,30.53 61.62,30.94 61.62,46.79 v62.03,47.19 | v60.6,48.62 J5.8 | IR2.OUT 79.2,28.4 79.2,29.67 78.64,30.23 73.61,30.23 73.61,29.72 72.85,28.96 71.73,28.96 71.73,31.5 70.61,32.61 v68.28,32.61 | v67.16,33.73 65.08,31.65 v63.14,31.65
  Bottom 0.203: v25.35,22 25.35,25.91 v27.79,25.91 | v32.61,30.89 33.68,31.95 v33.68,34.65 | v59.99,29.62 60.91,30.53 v62.03,30.53 v63.14,31.65 | v62.03,47.19 v60.6,48.62 | v67.16,33.73 v68.28,32.61 | v35.56,28.85 36.12,29.41 46.23,29.41 46.48,29.16 47.6,29.16 48.16,28.6 54.2,28.6 56.69,26.11 58.06,25.81 58.12,25.76 v58.17,25.81
DIO8  (via drill 0.3)
  Top 0.203: v41.05,36.27 41.05,34.7 43.64,34.7 PCHIP.29 | v34.04,38.46 31.85,40.64 PICSP.5 | v58.62,36.37 58.83,36.17 58.83,27.18 MCHIP.12 | v55.37,36.68 55.02,37.03 v55.02,39.52 | v55.02,41.15 54.36,41.81 J6.1
  Bottom 0.203: v34.04,38.46 38.86,38.46 v41.05,36.27 41.25,36.47 47.14,36.47 47.19,36.42 47.8,36.42 47.9,36.52 55.02,36.52 55.12,36.63 55.32,36.63 v55.37,36.68 58.62,36.68 v58.62,36.37 | v55.02,39.52 v55.02,41.15
DIO9  (via drill 0.3)
  Top 0.203: v27.89,13.51 27.89,13.46 27.48,13.06 27.48,12.6 26.11,12.6 24.74,13.97 24.74,14.53 24.54,14.73 VCHIP.29 | v31.55,11.02 31.85,11.02 32.26,11.43 35.51,11.43 35.92,11.84 v41.66,11.84 | v43.28,11.12 45.77,8.64 50.8,8.64 VICSP.5 | v55.47,25.81 57.25,25.81 57.81,26.36 57.81,26.92 58.01,27.13 MCHIP.13 | v48.01,21.89 48.72,22.61 48.72,23.32 v51.21,25.81 51.51,26.01 51.51,29.92 51.92,30.33 51.92,35.51 49.73,37.69 49.73,43.03 v49.63,43.13 | J6.2 53.09,49.53 v53.09,43.84
  Bottom 0.203: v27.89,13.51 29.57,11.84 30.73,11.84 v31.55,11.02 | v43.28,11.12 42.37,11.12 v41.66,11.84 41.71,11.89 41.71,15.6 v48.01,21.89 | v55.47,25.81 55.47,25.86 52.68,25.86 52.63,25.81 v51.21,25.81 | v53.09,43.84 52.38,43.13 v49.63,43.13
GND  (via drill 0.3)
  Top 0.356: U$8.SHLD3 2.74,48.41 5.23,48.41 5.23,47.6 U$8.SHLD1 5.18,47.4 4.32,46.53 4.32,43.43 5.13,42.62 5.28,42.62 | 5.28,42.62 5.28,41.35 U$8.SHLD2 | 5.28,42.62 5.28,43.03 5.38,43.13 U$8.G | U$8.SHLD4 2.74,40.49 5.13,40.49 5.13,41.25 U$8.SHLD2 | 12.5,28.85 12.5,35.56 D50.1 12.34,35.61 9.45,35.61 9.25,35.81 9.25,36.27 5.18,40.34 U$8.SHLD2 | 12.5,28.85 12.5,28.8 | 12.5,28.8 12.5,28.14 12.29,27.94 C1.2 | C20.2 21.59,28.8 12.5,28.8 | C43.2 v67.31,20.32 C45.1 | 68.58,25.91 69.65,25.91 Q40.4 | 68.58,25.91 68.58,26.62 67.77,27.43 67.51,27.43 Q40.2 | C45.1 67.41,22.15 68.58,23.32 68.58,25.91 | 61.67,22.45 61.67,22.91 61.98,23.22 62.69,23.22 MCHIP.5 | 61.67,22.45 61.67,22.05 62.03,21.69 62.69,21.69 MCHIP.3 | MCHIP.21 54.15,22.45 v57.86,22.45 61.67,22.45 | C35.1 40.64,45.31 v39.17,45.31 37.64,45.31 37.64,45.52 Q30.4 37.59,45.16 36.63,44.2 36.63,43.94 36.07,43.38 Q30.2 | C24.1 33.48,16.51 v34.7,17.73 35.36,18.39 35.36,20.78 Q20.4 | 12.95,3.2 12.09,2.34 10.87,2.34 IC1.1 | 12.95,3.2 13.97,4.22 C2.2 | 18.16,49.15 17.37,48.36 17.37,45.72 C50.2 | 18.16,49.15 19.05,50.04 L2.C | C25.1 33.43,25.4 33.22,25.2 v33.22,23.82 33.22,22.4 Q20.2 | 27.38,17.88 28.4,17.88 VCHIP.3 | 27.38,17.88 27.38,19.1 27.69,19.41 28.4,19.41 VCHIP.5 | v17.78,7.21 19.05,7.21 R75.1 | v24.49,8.43 24.49,7.57 24.13,7.21 R73.1 | v29.06,8.43 29.06,7.37 29.21,7.21 R74.1 | C21.2 v22.86,12.29 | C30.2 v24.13,33.43 | v18.64,43.13 18.64,41.91 C51.2 | v34.24,43.59 33.02,43.59 C34.1 | C44.1 72.39,25.81 72.75,25.45 72.75,21.18 U1.3 | IR2.GND 73.97,35.26 73.97,36.68 74.93,37.64 R1.2 | v21.18,18.69 19.86,18.69 VCHIP.21 | v39.78,31.34 39.78,30.02 PCHIP.21 39.78,29.82 39.78,27.38 v39.47,27.08
  Top 0.356: v38.96,37.24 38.96,38.56 PCHIP.5 | v40.59,39.93 40.59,38.61 PCHIP.3 | v13.82,39.73 13.82,40.95 D51.1 | v27.08,17.27 27.28,17.48 27.28,17.68 27.33,17.73 27.38,17.88 | 18.16,49.15 v18.09,49.23 | 12.95,3.2 v12.85,3.3 | 12.5,28.85 4.27,28.85 4.27,27.33 X2.A2 | v23.62,16.66 23.27,17.02 v23.27,20.42 | v47.19,45.31 v47.19,43.69 | v66.09,23.27 67.21,22.15 C45.1
  pour Bottom: 1.27,52.07 80.01,52.07 80.01,1.27 1.27,1.27
KBCLK  (via drill 0.3)
  Top 0.203: v21.74,16.76 21.59,16.92 21.59,17.02 19.86,17.02 VCHIP.23 | v18.09,16.31 18.49,15.9 18.49,12.6 v20.22,10.87
  Bottom 0.203: v21.74,16.76 21.74,16.97 20.78,16.97 20.78,17.58 v18.09,16.31 | v20.22,10.87 21.84,9.25 25.45,9.25 26.67,8.03 28.35,8.03 28.75,7.62 33.93,7.62 41.3,14.99 41.3,23.06 46.94,23.06 47.6,23.72 53.95,23.72 55.27,22.4 56.79,22.4 58.32,20.88 63.4,20.88 63.75,20.52 64.47,20.52 64.77,20.83 66.7,20.83 67,21.13 70.26,21.13 U1.5
KBDATA  (via drill 0.3)
  Top 0.203: v25.3,10.26 24.33,11.23 24.33,13.11 21.59,13.11 20.73,13.97 20.73,15.34 19.86,16.2 VCHIP.24 | v33.07,9.5 36.02,9.5 40.34,5.18 v47.24,5.18 | v70.05,9.96 74.32,14.22 74.32,19.2 v74.57,19.46
  Bottom 0.203: v25.3,10.26 26.06,9.5 v33.07,9.5 | v47.24,5.18 48.21,4.22 48.97,4.22 49.58,3.61 49.58,3.56 53.95,3.56 53.95,3.86 54.61,3.86 55.52,4.78 64.87,4.78 v70.05,9.96 | v74.57,19.46 74.57,19.36 73.05,19.36 72.8,19.1 U1.1
MISO  (via drill 0.3)
  Top 0.203: 44.2,47.85 50.8,47.85 R32.1 | 44.2,47.85 J6.5 | v53.95,27.13 55.58,27.13 MCHIP.16 | v52.32,26.62 52.02,26.31 v51.61,21.13 | v57.45,15.7 59.84,13.31 59.84,6.71 v59.44,6.3 | v57.45,5.99 55.88,7.57 MICSP.1 | v25.04,4.37 36.47,4.37 39.73,1.12 52.32,1.12 52.32,5.64 v53.8,7.11 | v40.59,42.16 40.69,42.16 41.45,42.93 41.45,45.11 44.2,47.85 | v47.5,37.24 47.19,36.93 47.19,33.07 v45.97,31.85 | v48.31,29.57 50.7,27.18 v50.7,26.98
  Bottom 0.203: v53.95,27.13 53.44,26.62 v52.32,26.62 52.27,26.67 51,26.67 v50.7,26.98 | v51.61,21.13 51.61,21.03 51.56,20.78 51.56,19.71 52.02,19.71 56.03,15.7 v57.45,15.7 | v59.44,6.3 59.13,5.99 v57.45,5.99 | v25.04,4.37 25.04,5.79 U$9.7 | v53.8,7.11 54.25,7.57 55.83,7.57 MICSP.1 | v40.59,42.16 45.52,37.24 v47.5,37.24 | v45.97,31.85 45.97,31.6 46.18,31.39 46.23,31.39 46.23,31.34 46.28,31.34 46.28,31.29 46.33,31.29 46.33,31.24 46.38,31.24 46.38,29.82 46.43,29.82 46.69,29.57 v48.31,29.57
MOSI  (via drill 0.3)
  Top 0.203: 50.09,44.76 49.43,45.41 49.43,46.13 48.62,46.94 v48.62,47.04 | 50.09,44.76 50.8,44.04 R31.1 | v46.99,48.67 46.74,48.92 J6.4 | 41.05,23.82 41.05,24.69 42.16,25.81 v46.28,25.81 | 41.05,23.82 41.05,23.52 36.93,19.41 36.93,15.7 31.19,15.7 28.3,12.8 28.3,9.45 24.38,9.45 23.67,8.74 23.67,8.43 22.81,8.43 21.59,7.21 R70.2 | v52.32,27.79 51.92,28.19 51.92,29.72 52.38,30.18 | 52.38,30.18 52.43,30.23 53.54,30.23 53.54,29.16 54.61,28.09 56.39,28.09 56.39,27.18 MCHIP.15 | MICSP.4 57.81,10.77 57.81,11.38 56.95,12.24 v55.73,12.24 | v53.7,12.29 49.02,16.97 47.55,16.97 47.55,17.48 v47.24,17.78 | v46.08,18.85 41.1,23.82 41.05,23.82 | v48.92,42.42 48.82,42.52 48.82,43.48 50.09,44.76 | v52.32,37.95 52.32,30.23 52.38,30.18
  Bottom 0.203: v48.62,47.04 v46.99,48.67 | v46.28,25.81 48.26,27.79 v52.32,27.79 | v55.73,12.24 55.68,12.29 v53.7,12.29 | v47.24,17.78 46.18,18.85 v46.08,18.85 | v48.92,42.42 49.43,41.91 52.07,41.91 54.15,39.83 54.15,38.2 52.83,38.2 52.58,37.95 v52.32,37.95
MOSI33  (via drill 0.3)
  Top 0.203: R73.2 24.13,5.49 21.59,5.49 R70.1 21.54,5.44 21.54,5.28 v20.62,4.37
  Bottom 0.203: v20.62,4.37 20.62,5.79 U$9.3
N$2
  Top 0.203: IR1.K 78.74,39.83 74.93,36.02 R1.1
N$3
  Top 0.203: L2.A 19.05,51.56 21.59,51.56 R53.2
N$4
  Top 0.203: 35.1,45.31 36.02,45.31 36.02,45.52 Q30.1 | 35.1,45.31 33.02,45.31 C34.2 | PCHIP.8 36.52,38.61 36.32,38.81 36.32,41.3 35.1,42.52 35.1,45.31
N$5
  Top 0.203: C1.1 10.62,27.94 10.62,26.62 11.84,25.4 R4.1 11.43,25.7 X2.B2
N$8
  Top 0.203: F1.1 6.4,47.7 6.4,46.38 5.79,45.77 5.44,45.77 U$8.V
N$9  (via drill 0.3)
  Top 0.203: v22.76,16.1 22.76,19.56 20.78,21.54 20.78,22.15 21.13,22.5 21.13,23.16 21.29,23.32 VCHIP.16 | v32.26,10.31 35.81,10.31 39.32,6.81 43.08,6.81 43.43,6.45 45.72,6.45 VICSP.1
  Bottom 0.203: v22.76,16.1 28.65,10.21 32.16,10.21 v32.26,10.31
N$10
  Top 0.203: C24.2 35.15,16.51 36.42,17.78 36.42,21.49 35.56,22.35 35.41,22.35 Q20.1 35.46,22.45 35.46,23.98 36.02,24.54 36.02,26.21 32.77,26.21 28.45,21.89 VCHIP.8
N$11
  Top 0.203: C25.2 35.1,25.4 34.24,24.54 34.24,21.69 33.38,20.83 33.22,20.83 Q20.3 33.22,20.93 33.22,21.03 28.45,21.03 VCHIP.7
N$12
  Top 0.203: R20.2 12.24,15.9 10.36,17.78 10.36,20.32 D20.3
N$13  (via drill 0.3)
  Top 0.203: v22.3,21.13 23.52,22.35 23.52,23.11 23.72,23.32 VCHIP.13 | v18.09,18.69 17.22,17.83 17.22,12.34 13.82,8.94 D21.1
  Bottom 0.203: v22.3,21.13 19.86,18.69 v18.09,18.69
N$14
  Top 0.203: R21.1 12.24,13.31 11.63,12.7 11.63,9.86 D21.3
N$15
  Top 0.203: R20.1 10.62,15.85 10.62,13.36 R21.2 10.52,13.26 9.04,11.79 9.04,9.35 X2.B1
N$23
  Top 0.203: C35.2 40.64,43.59 37.64,43.59 37.64,43.38 Q30.3 37.54,43.33 37.54,38.76 37.39,38.61 PCHIP.7
N$24  (via drill 0.3)
  Top 0.203: v13.31,22.61 19.1,22.61 19.81,21.89 VCHIP.17 | v12.19,23.72 9.6,21.13 6.66,21.13 6.66,5.28 5.79,4.42 5.79,3.2 7.52,1.47 37.19,1.47 v37.19,2.54 | v40.64,5.99 48.26,5.99 VICSP.3
  Bottom 0.203: v12.19,23.72 v13.31,22.61 | v37.19,2.54 v40.64,5.99
N$28
  Top 0.203: C44.2 72.39,27.48 69.7,27.48 Q40.1 69.6,27.53 69.6,28.4 65.43,28.4 62.74,25.7 MCHIP.8
N$29
  Top 0.203: 67.46,24.89 67.46,25.86 Q40.3 | 67.46,24.89 67.46,23.88 67.31,23.72 C45.2 | MCHIP.7 62.74,24.89 67.46,24.89
N$30
  Top 0.203: J4.1 62.03,2.54 57.4,7.16 57.4,11.18 55.68,11.18 54.91,11.94 54.91,19.25 55.07,19.41 55.07,20.83 54.15,20.83 MCHIP.23
N$31
  Top 0.203: J4.2 66.04,1.52 62.43,1.52 60.4,3.56 58.47,3.56 54.51,7.52 54.51,19.66 54.15,20.02 MCHIP.24
N$32  (via drill 0.3)
  Top 0.203: v59.03,11.89 55.83,15.09 55.83,18.34 55.63,18.54 MCHIP.25 | v62.84,11.94 68.58,6.2 J4.3
  Bottom 0.203: v59.03,11.89 59.08,11.94 v62.84,11.94
N$33  (via drill 0.3)
  Top 0.203: v59.03,13.01 56.59,15.44 56.59,18.39 56.44,18.54 MCHIP.26 | v62.84,13.01 68.83,13.01 68.83,6.55 71.12,4.27 J4.4
  Bottom 0.203: v59.03,13.01 v62.84,13.01
N$34  (via drill 0.3)
  Top 0.203: v60.4,16.41 58.83,16.41 57.4,17.83 57.4,18.39 57.25,18.54 MCHIP.27 | v68.94,14.63 69.24,14.33 69.24,6.96 J4.5
  Bottom 0.203: v60.4,16.41 60.55,16.26 63.14,16.26 63.35,16.05 67.21,16.05 68.22,17.07 68.83,17.07 69.34,16.56 69.34,14.63 v68.94,14.63
N$35  (via drill 0.3)
  Top 0.203: v59.38,20.07 58.93,20.07 58.22,19.36 58.22,18.75 58.06,18.59 MCHIP.28 | v75.49,9.04 76.2,8.33 J4.6
  Bottom 0.203: v59.38,20.07 59.44,20.12 64.82,20.12 64.82,20.27 66.24,20.27 70.56,15.95 71.17,15.95 71.22,15.9 71.22,13.06 71.48,13.06 v75.49,9.04
N$37  (via drill 0.3)
  Top 0.203: v26.82,50.04 27.94,48.92 R2.1
  Bottom 0.203: v26.82,50.04 27.94,50.04 L1.A
PIXEL1  (via drill 0.3)
  Top 0.203: v21.59,21.84 21.95,22.2 21.95,23.16 22.1,23.32 VCHIP.15 | 16.1,19.41 v18.49,21.79 | 16.1,19.41 12.55,19.41 D20.1 | v46.53,12.09 42.47,12.09 42.47,12.14 41.96,12.65 33.73,12.65 33.73,12.6 32.97,11.84 29.62,11.84 29.62,8.99 30.07,8.53 30.07,6.55 29.87,6.35 27.94,6.35 v27.94,6.5 | v16.41,13.56 16.15,13.82 16.15,19.36 16.1,19.41
  Bottom 0.203: v21.59,21.84 21.54,21.79 v18.49,21.79 | VICSP.4 48.26,10.72 47.65,10.72 47.65,11.43 47.19,11.43 v46.53,12.09 | v27.94,6.5 26.82,7.62 23.62,7.62 22.4,8.13 21.13,8.13 17.98,10.87 16.41,12.45 v16.41,13.56
PMISO  (via drill 0.3)
  Top 0.203: v49.63,47.04 49.63,47.14 49.84,47.14 50.8,46.18 R32.2 | v38.71,48.97 37.13,47.4 28.8,47.4 28.8,47.19 28.6,46.99 26.67,46.99 PICSP.4 27.69,42.16 27.69,37.24 28.65,36.27 28.65,33.53 v30.99,31.19 | v36.42,31.39 36.42,31.5 35.71,32.21 35.71,32.26 35.1,32.26 PCHIP.15
  Bottom 0.203: v49.63,47.04 49.38,47.3 49.38,48.97 48.26,48.97 47.75,49.48 46.48,49.48 46.48,49.33 46.13,49.33 45.77,48.97 v38.71,48.97 | v36.42,31.39 36.32,31.29 34.14,31.29 32.92,30.07 32.11,30.07 v30.99,31.19
PMOSI  (via drill 0.3)
  Top 0.203: v50.55,41.1 50.55,42.06 50.8,42.32 R31.2 | v48.92,39.78 49.33,39.37 49.33,34.09 46.13,30.89 v45.57,30.89 | v35.56,30.48 35.1,30.94 35.1,31.45 PCHIP.16 | PICSP.1 26.16,38.61 26.16,33.43 v25.76,33.02
  Bottom 0.203: v50.55,41.1 49.23,39.78 v48.92,39.78 | v45.57,30.89 45.16,30.48 v35.56,30.48 34.75,29.67 29.11,29.67 v25.76,33.02
PSCK  (via drill 0.3)
  Top 0.203: v55.07,33.63 56.59,35.15 56.59,38 57.96,39.37 R30.2 | v51.1,35.1 49.43,33.58 49.43,32.41 46.38,29.36 v46.38,28.35 | v36.58,28.6 36.58,29.97 PCHIP.17 36.52,29.67 34.95,29.67 v32.61,32 | v30.99,36.27 31.04,36.22 v31.04,34.65
  Bottom 0.203: v55.07,33.63 55.02,33.58 v51.1,35.1 | v46.38,28.35 46.13,28.6 v36.58,28.6 | PICSP.3 26.67,38.35 28.91,38.35 v30.99,36.27 | v31.04,34.65 31.9,33.78 31.9,32 v32.61,32
SCK  (via drill 0.3)
  Top 0.203: 55.63,35.31 54.25,33.93 54.25,29.57 v54.36,29.46 | 55.63,35.31 56.19,35.87 56.19,39.27 56.29,39.37 R30.1 | v52.73,29.41 53.14,29.01 53.14,26.67 54.1,25.7 MCHIP.17 | v31.34,14.73 30.84,14.73 29.21,13.11 29.21,9.75 26.67,7.21 R71.2 | v30.23,15.85 30.18,15.9 v30.18,20.22 | v26.16,25.09 26.57,25.5 26.57,35.61 v27.38,36.42 | v28.5,37.54 28.09,37.95 28.09,44.6 27.94,44.76 R2.2 27.99,45.77 29.21,46.99 37.85,46.99 J6.6 41.71,50.85 41.71,52.22 49.33,52.22 50.29,51.26 50.29,50.24 51.66,48.87 51.66,41.2 v52.07,40.79 | v46.58,13.11 34.14,13.11 v34.14,13.46 | v53.34,39.52 53.54,39.32 53.54,37.39 55.63,35.31
  Bottom 0.203: v54.36,29.46 54.3,29.41 v52.73,29.41 | v30.23,15.85 v31.34,14.73 31.39,14.68 32.92,14.68 v34.14,13.46 | v30.18,20.22 26.16,24.23 v26.16,25.09 | v27.38,36.42 v28.5,37.54 | MICSP.3 58.42,8.18 57.51,8.18 57.51,8.64 54.15,8.64 52.58,10.21 52.58,13.11 v46.58,13.11 | v52.07,40.79 v53.34,39.52
SCK33  (via drill 0.3)
  Top 0.203: R74.2 29.21,5.49 26.67,5.49 R71.1 26.62,5.59 26.62,6.35 23.47,6.35 23.27,6.55 23.27,6.86 v22.86,7.26
  Bottom 0.203: v22.86,7.26 22.86,5.84 U$9.5
SS  (via drill 0.3)
  Top 0.203: v58.01,32.05 57.4,31.45 57.4,27.33 57.25,27.18 MCHIP.14 | v62.43,40.54 v62.43,35.97 | v53.54,42.27 52.07,43.74 52.07,49.07 50.7,50.44 v50.7,51.97 | v12.24,7.26 12.24,7.21 16.51,7.21 R72.2 | v11.12,8.38 11.63,8.38 12.24,8.99 12.75,8.99 12.75,12.29 13.11,12.65 13.11,17.12 11.48,18.75 11.48,21.89 13.56,23.98 v19.81,23.98 | v27.79,26.92 31.24,30.38 31.65,30.38 31.65,30.73 31.8,30.89 31.8,32.31 32.56,33.07 32.72,33.07 | 32.72,33.07 35.05,33.07 PCHIP.14 | J6.3 47.75,50.8 47.75,51.26 47.19,51.82 42.67,51.82 42.67,50.34 38.91,46.58 32.21,46.58 v32.21,41.91 | 32.72,33.07 v32.72,33.02
  Bottom 0.203: v58.01,32.05 58.06,32.11 59.54,32.11 61.67,34.24 61.67,35.26 v62.43,35.97 | v62.43,40.54 60.71,42.27 v53.54,42.27 | v50.7,51.97 50.7,52.07 49.73,52.07 49.73,50.8 J6.3 | v12.24,7.26 v11.12,8.38 | v19.81,23.98 20.42,24.59 22.76,24.59 25.09,26.92 v27.79,26.92 | v32.21,41.91 32.21,36.22 32.72,35.71 v32.72,33.02
SS33  (via drill 0.3)
  Top 0.203: R72.1 16.51,5.49 19.05,5.49 R75.2 19.1,5.59 19.91,6.4 19.91,7.57 v20.27,7.92
  Bottom 0.203: v20.27,7.92 19.56,7.92 19.56,6.25 U$9.2
USB_D+  (via drill 0.3)
  Top 0.203: v22.3,36.83 15.6,36.83 13.06,39.37 R51.2 | v29.46,33.83 35.05,33.83 35.05,33.88 PCHIP.13 35.15,33.83 35.71,33.83 36.02,33.53 36.02,33.02 v36.52,32.51 | v38.2,31.75 39.78,33.33 39.78,37.08 43.64,37.08 PCHIP.32
  Bottom 0.203: v22.3,36.83 25.3,33.83 v29.46,33.83 | v38.2,31.75 38.15,31.8 37.13,31.8 36.52,32.41 v36.52,32.51
USB_D-  (via drill 0.3)
  Top 0.203: v23.32,46.08 22.3,45.06 22.3,41.1 16.26,41.1 15.95,41.4 15.95,44.45 R50.2 | v28.8,45.01 31.19,45.01 31.19,41.81 31.9,41.1 35.92,41.1 35.92,37.64 36.02,37.54 36.02,35.05 35.66,34.7 35.1,34.7 PCHIP.12
  Bottom 0.203: v23.32,46.08 24.64,47.4 26.42,47.4 v28.8,45.01

### Text on the board
tPlace: Tvikia | zc19a | bcg | 1 | 1 | 1